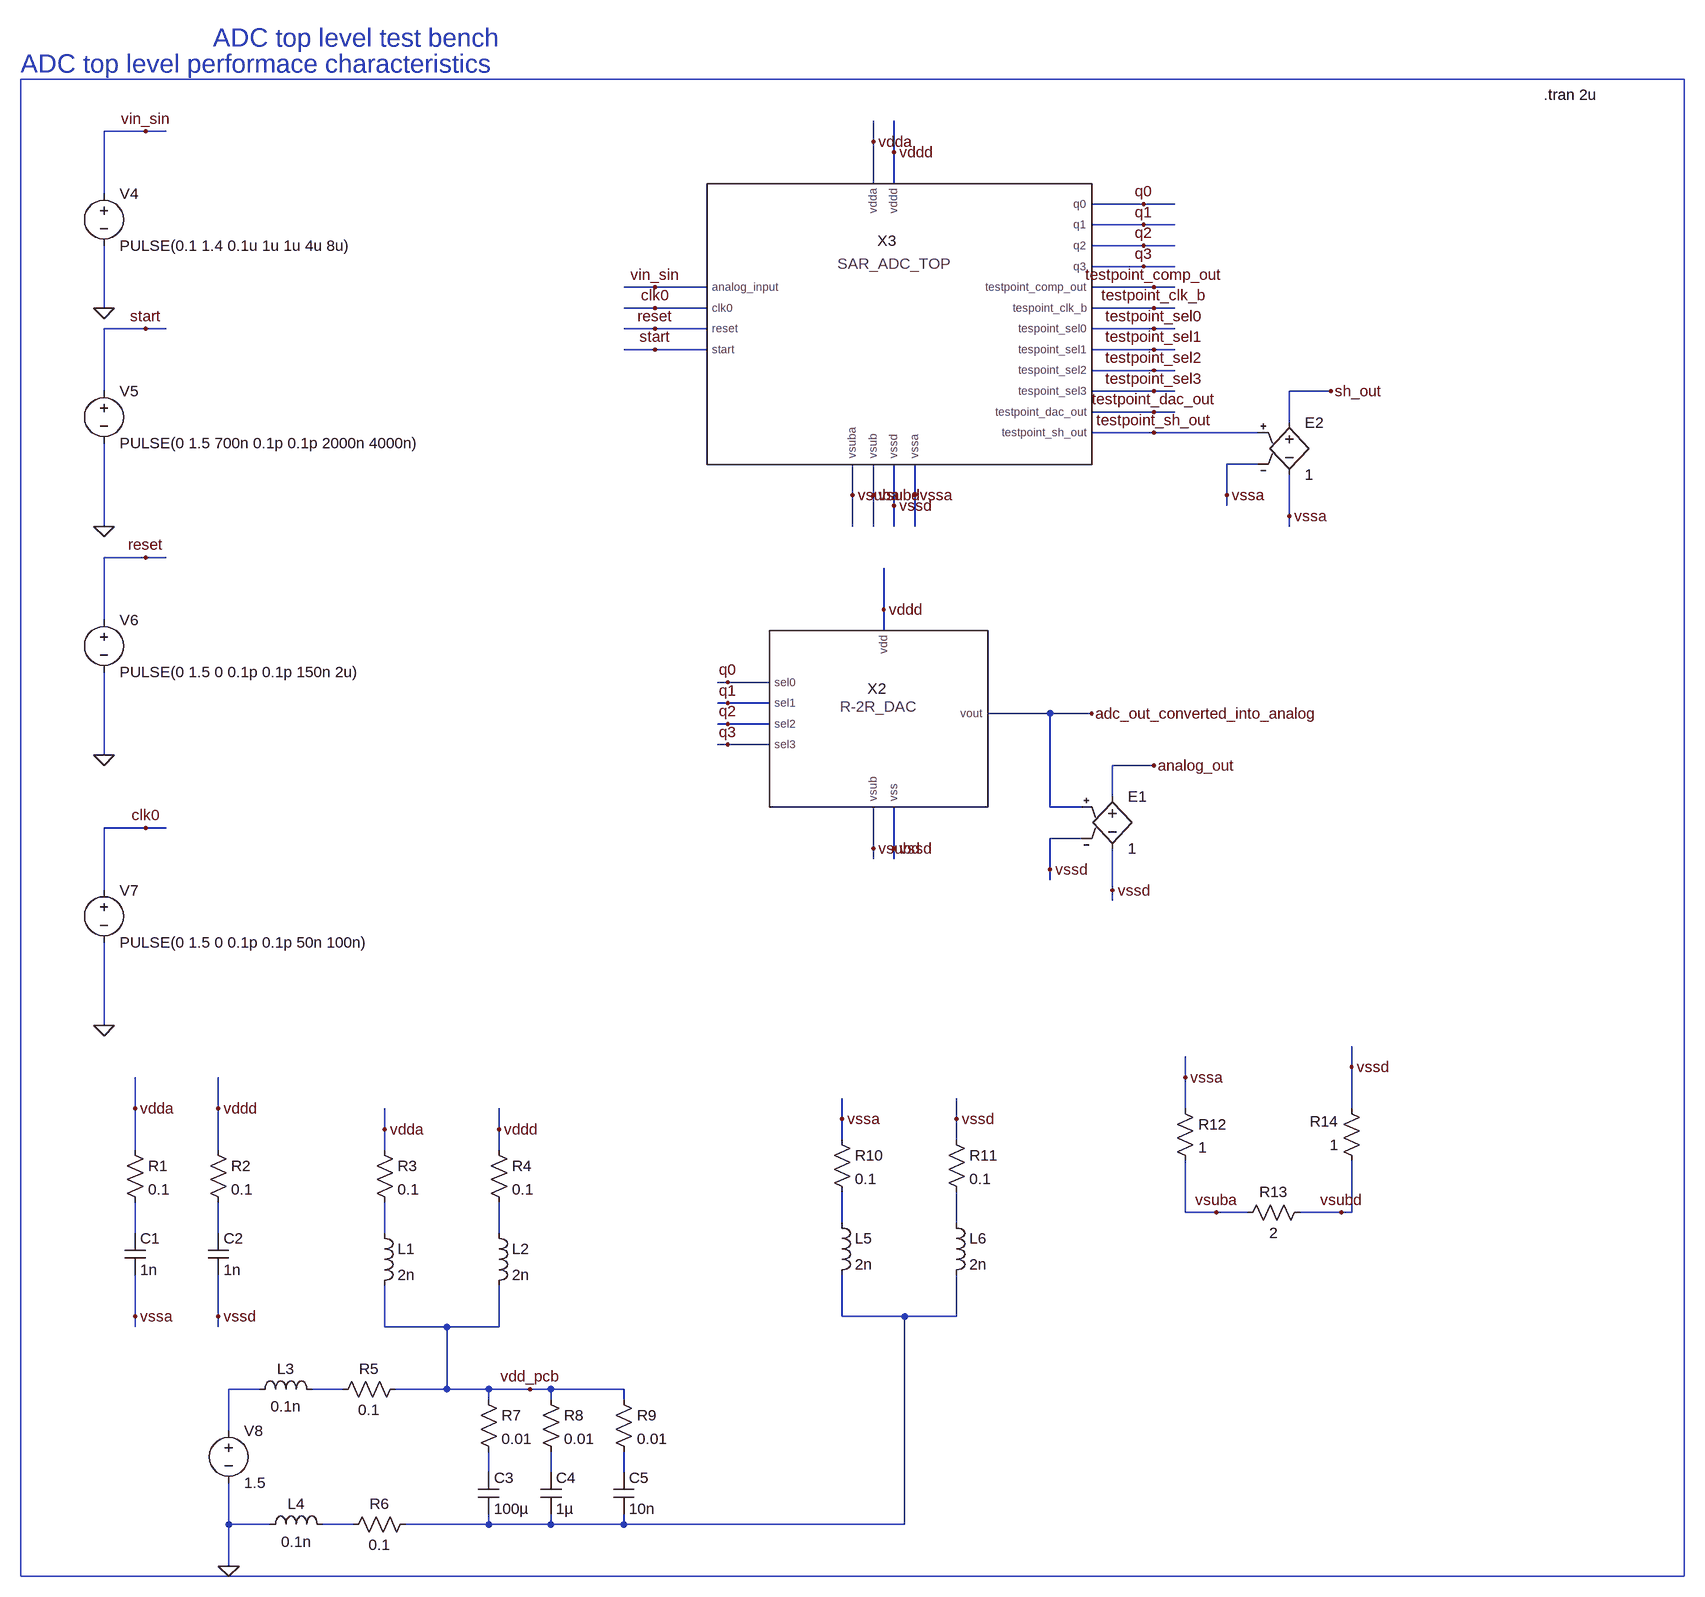
[diagram p0: schematic dsproj_adctop_perfCharacteristics_pdneffects.asc]
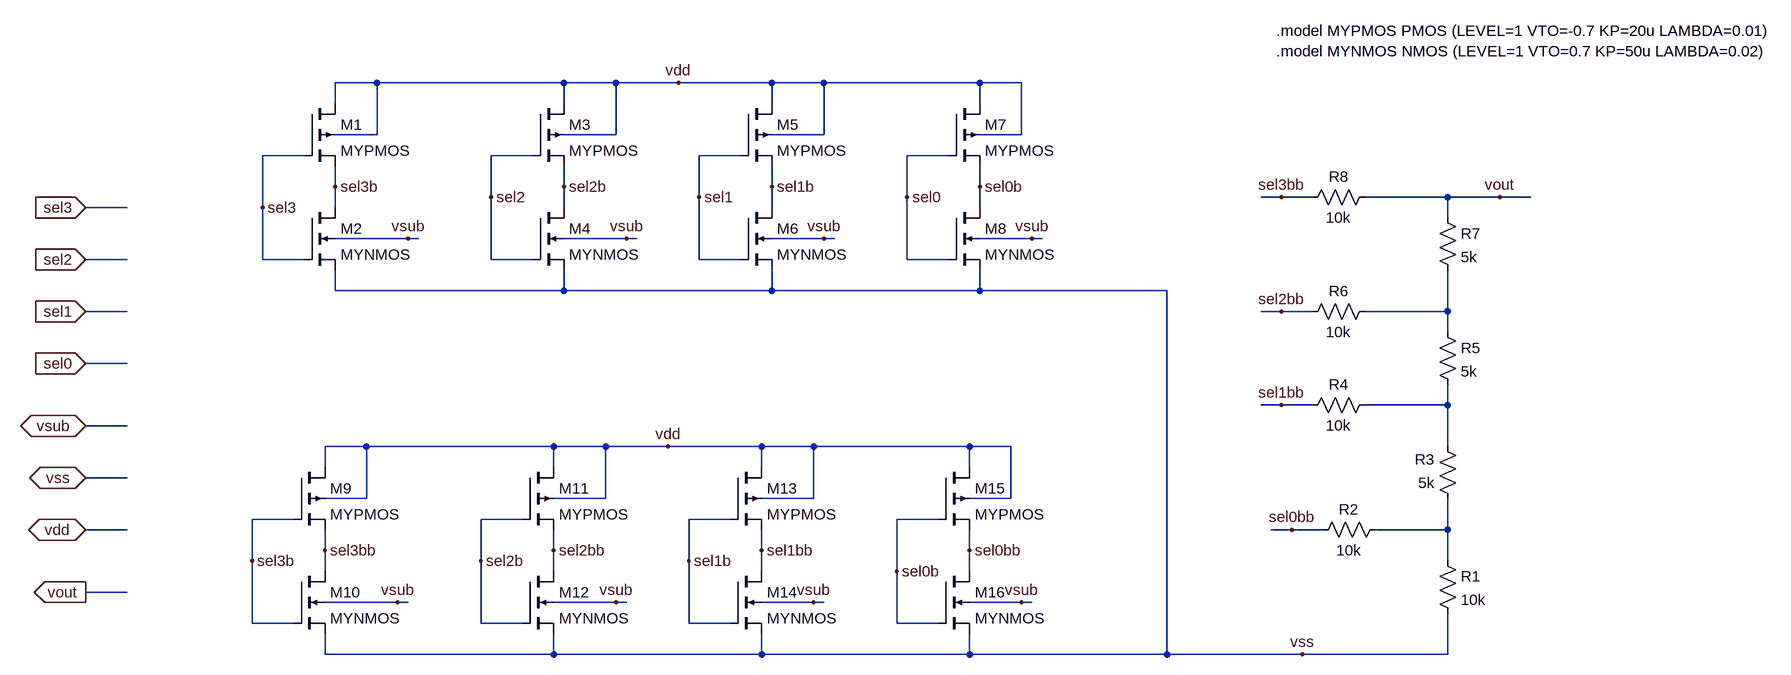
[diagram p1: sub-circuit dsproj_r2rdac.asc]
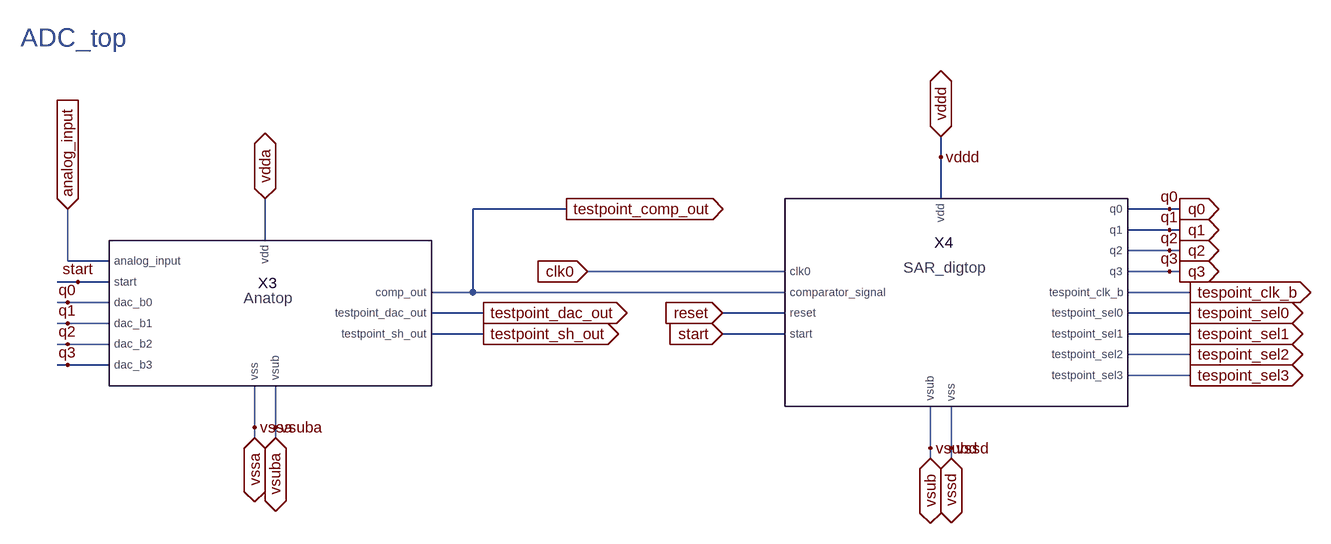
[diagram p2: sub-circuit dsproj_adctop.asc]
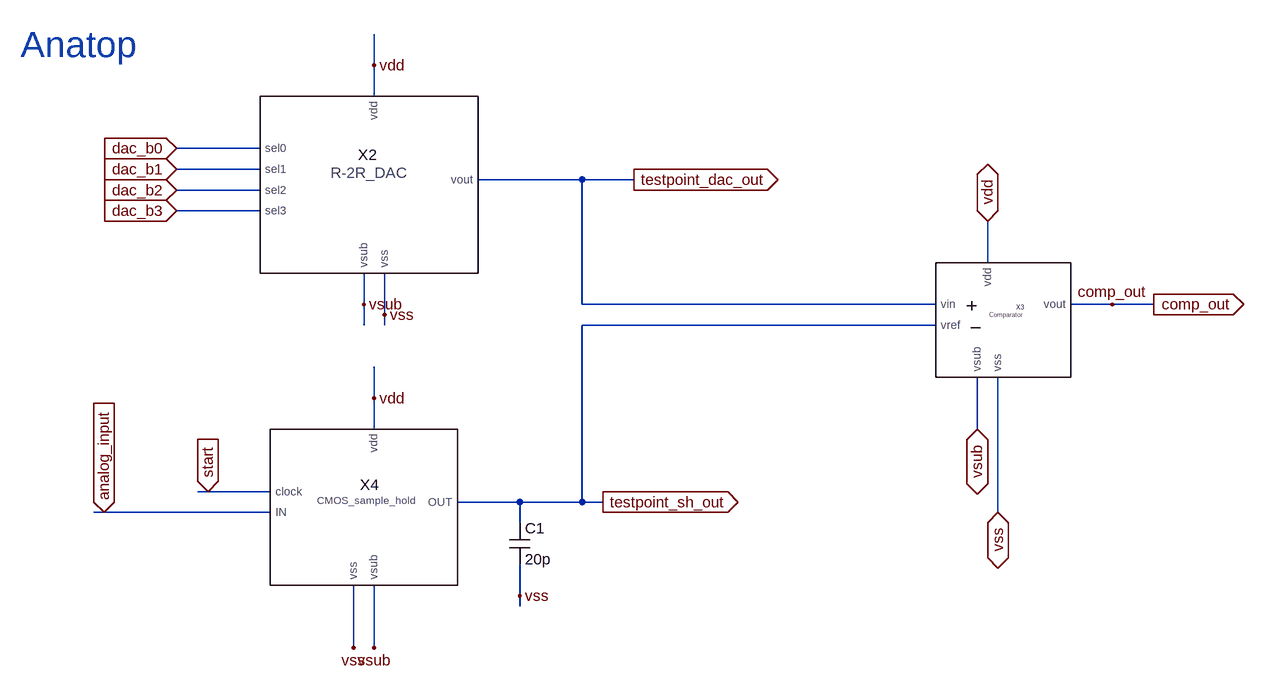
[diagram p3: sub-circuit dsproj_anatop.asc]
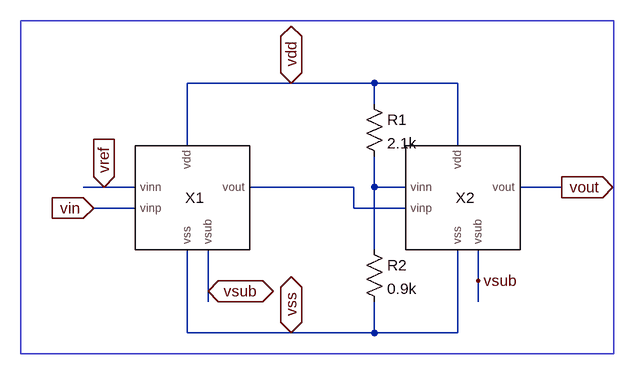
[diagram p4: sub-circuit dsproj_twostagecomparator.asc]
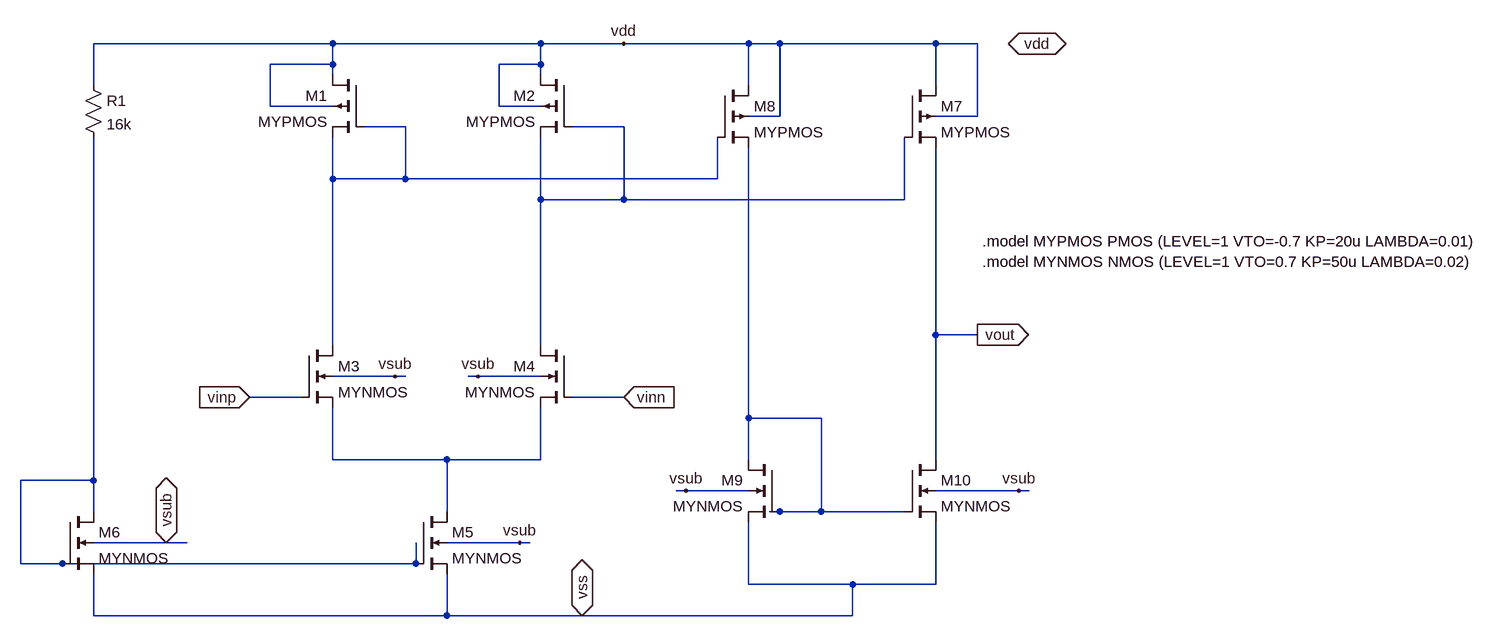
[diagram p5: sub-circuit dsproj_nmos_comparator.asc]
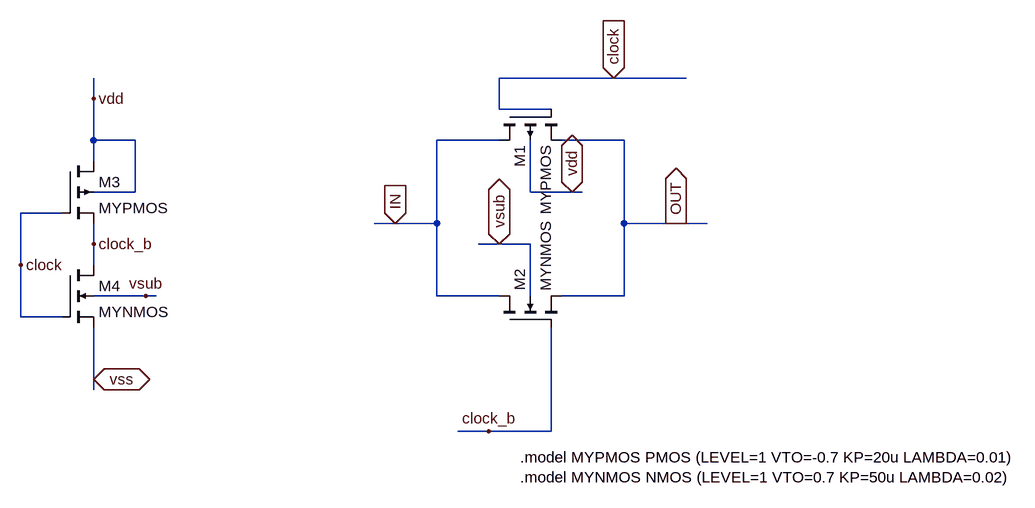
[diagram p6: sub-circuit dsproj_cmossampleandhold.asc]
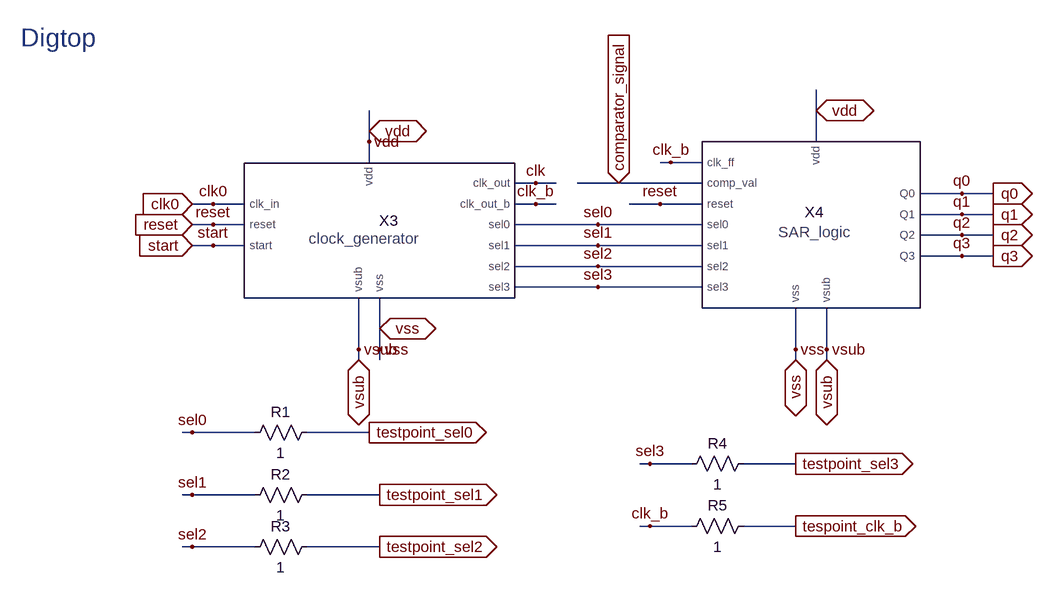
[diagram p7: sub-circuit dsproj_digtop.asc]
dsproj_adctop_perfCharacteristics_pdneffects.asc, the LTspice schematic file:
Version 4.1
SHEET 1 2676 2148
WIRE -352 -192 -416 -192
WIRE -320 -192 -352 -192
WIRE 768 -176 768 -208
WIRE 800 -160 800 -208
WIRE 768 -112 768 -176
WIRE 800 -112 800 -160
WIRE -416 -96 -416 -192
WIRE 1184 -80 1104 -80
WIRE 1232 -80 1184 -80
WIRE 1184 -48 1104 -48
WIRE 1232 -48 1184 -48
WIRE 1184 -16 1104 -16
WIRE 1232 -16 1184 -16
WIRE 1184 16 1104 16
WIRE 1232 16 1184 16
WIRE 432 48 384 48
WIRE 512 48 432 48
WIRE 1200 48 1104 48
WIRE 1232 48 1200 48
WIRE -416 80 -416 -16
WIRE 432 80 384 80
WIRE 512 80 432 80
WIRE 1200 80 1104 80
WIRE 1232 80 1200 80
WIRE -352 112 -416 112
WIRE -320 112 -352 112
WIRE 432 112 384 112
WIRE 512 112 432 112
WIRE 1200 112 1104 112
WIRE 1232 112 1200 112
WIRE 432 144 384 144
WIRE 512 144 432 144
WIRE 1200 144 1104 144
WIRE 1232 144 1200 144
WIRE 1200 176 1104 176
WIRE 1232 176 1200 176
WIRE -416 208 -416 112
WIRE 1200 208 1104 208
WIRE 1232 208 1200 208
WIRE 1472 208 1408 208
WIRE 1200 240 1104 240
WIRE 1232 240 1200 240
WIRE 1408 256 1408 208
WIRE 1200 272 1104 272
WIRE 1360 272 1200 272
WIRE 1360 320 1312 320
WIRE 736 368 736 320
WIRE 768 368 768 320
WIRE 832 368 832 320
WIRE 1312 368 1312 320
WIRE 800 384 800 320
WIRE 1312 384 1312 368
WIRE 1408 400 1408 336
WIRE -416 416 -416 288
WIRE 736 416 736 368
WIRE 768 416 768 368
WIRE 800 416 800 384
WIRE 832 416 832 368
WIRE 1408 416 1408 400
WIRE -352 464 -416 464
WIRE -320 464 -352 464
WIRE 784 544 784 480
WIRE -416 560 -416 464
WIRE 784 576 784 544
WIRE 544 656 528 656
WIRE 608 656 544 656
WIRE 544 688 528 688
WIRE 608 688 544 688
WIRE 1040 704 944 704
WIRE 1104 704 1040 704
WIRE 544 720 528 720
WIRE 608 720 544 720
WIRE 544 752 528 752
WIRE 608 752 544 752
WIRE -416 768 -416 640
WIRE 1200 784 1136 784
WIRE 1136 832 1136 784
WIRE 1040 848 1040 704
WIRE 1088 848 1040 848
WIRE -352 880 -416 880
WIRE -320 880 -352 880
WIRE 1088 896 1040 896
WIRE 768 912 768 848
WIRE 800 912 800 848
WIRE 768 928 768 912
WIRE 800 928 800 912
WIRE 1040 944 1040 896
WIRE 1040 960 1040 944
WIRE -416 976 -416 880
WIRE 1136 976 1136 912
WIRE 1136 992 1136 976
WIRE -416 1184 -416 1056
WIRE 1504 1248 1504 1216
WIRE 1248 1264 1248 1232
WIRE -368 1312 -368 1264
WIRE -240 1312 -240 1264
WIRE 1248 1312 1248 1264
WIRE 1504 1312 1504 1248
WIRE 720 1328 720 1296
WIRE 896 1328 896 1296
WIRE 16 1344 16 1312
WIRE 192 1344 192 1312
WIRE 720 1360 720 1328
WIRE 896 1360 896 1328
WIRE -368 1376 -368 1312
WIRE -240 1376 -240 1312
WIRE 16 1376 16 1344
WIRE 192 1376 192 1344
WIRE 1248 1472 1248 1392
WIRE 1296 1472 1248 1472
WIRE 1344 1472 1296 1472
WIRE 1488 1472 1424 1472
WIRE 1504 1472 1504 1392
WIRE 1504 1472 1488 1472
WIRE 720 1488 720 1440
WIRE 896 1488 896 1440
WIRE -368 1504 -368 1456
WIRE -240 1504 -240 1456
WIRE 16 1504 16 1456
WIRE 192 1504 192 1456
WIRE -368 1632 -368 1568
WIRE -240 1632 -240 1568
WIRE 720 1632 720 1568
WIRE 816 1632 720 1632
WIRE 896 1632 896 1568
WIRE 896 1632 816 1632
WIRE -368 1648 -368 1632
WIRE -240 1648 -240 1632
WIRE 16 1648 16 1584
WIRE 112 1648 16 1648
WIRE 192 1648 192 1584
WIRE 192 1648 112 1648
WIRE -176 1744 -224 1744
WIRE -48 1744 -96 1744
WIRE 112 1744 112 1648
WIRE 112 1744 32 1744
WIRE 176 1744 112 1744
WIRE 240 1744 176 1744
WIRE 272 1744 240 1744
WIRE 384 1744 272 1744
WIRE 176 1760 176 1744
WIRE 272 1760 272 1744
WIRE 384 1760 384 1744
WIRE -224 1808 -224 1744
WIRE 176 1872 176 1840
WIRE 272 1872 272 1840
WIRE 384 1872 384 1840
WIRE -224 1952 -224 1888
WIRE -160 1952 -224 1952
WIRE -32 1952 -80 1952
WIRE 176 1952 176 1936
WIRE 176 1952 48 1952
WIRE 272 1952 272 1936
WIRE 272 1952 176 1952
WIRE 384 1952 384 1936
WIRE 384 1952 272 1952
WIRE 816 1952 816 1632
WIRE 816 1952 384 1952
WIRE -224 2016 -224 1952
FLAG 768 -176 vdda
FLAG 800 -160 vddd
FLAG 736 368 vsuba
FLAG 768 368 vsubd
FLAG 800 384 vssd
FLAG 832 368 vssa
FLAG 1184 -80 q0
FLAG 1184 -48 q1
FLAG 1184 -16 q2
FLAG 1184 16 q3
FLAG 1200 80 testpoint_clk_b
FLAG 1200 112 testpoint_sel0
FLAG 1200 144 testpoint_sel1
FLAG 1200 176 testpoint_sel2
FLAG 1200 208 testpoint_sel3
FLAG 1200 240 testpoint_dac_out
FLAG 1200 272 testpoint_sh_out
FLAG 1200 48 testpoint_comp_out
FLAG 432 48 vin_sin
FLAG 432 80 clk0
FLAG 432 112 reset
FLAG 432 144 start
FLAG -416 80 0
FLAG -352 -192 vin_sin
FLAG -416 416 0
FLAG -352 112 start
FLAG -416 768 0
FLAG -352 464 reset
FLAG -416 1184 0
FLAG -352 880 clk0
FLAG 544 656 q0
FLAG 544 688 q1
FLAG 544 720 q2
FLAG 544 752 q3
FLAG 784 544 vddd
FLAG 768 912 vsubd
FLAG 800 912 vssd
FLAG 1104 704 adc_out_converted_into_analog
FLAG 1040 944 vssd
FLAG 1136 976 vssd
FLAG 1200 784 analog_out
FLAG 1312 368 vssa
FLAG 1408 400 vssa
FLAG 1472 208 sh_out
FLAG -368 1632 vssa
FLAG -368 1312 vdda
FLAG -240 1632 vssd
FLAG -240 1312 vddd
FLAG 16 1344 vdda
FLAG 192 1344 vddd
FLAG -224 2016 0
FLAG 240 1744 vdd_pcb
FLAG 720 1328 vssa
FLAG 896 1328 vssd
FLAG 1248 1264 vssa
FLAG 1504 1248 vssd
FLAG 1296 1472 vsuba
FLAG 1488 1472 vsubd
SYMBOL voltage -416 -112 R0
WINDOW 123 0 0 Left 0
WINDOW 39 0 0 Left 0
SYMATTR InstName V4
SYMATTR Value PULSE(0.1 1.4 0.1u 1u 1u 4u 8u)
SYMBOL voltage -416 192 R0
WINDOW 123 0 0 Left 0
WINDOW 39 0 0 Left 0
SYMATTR InstName V5
SYMATTR Value PULSE(0 1.5 700n 0.1p 0.1p 2000n 4000n)
SYMBOL voltage -416 544 R0
WINDOW 123 0 0 Left 0
WINDOW 39 0 0 Left 0
SYMATTR InstName V6
SYMATTR Value PULSE(0 1.5 0 0.1p 0.1p 150n 2u)
SYMBOL voltage -416 960 R0
WINDOW 123 0 0 Left 0
WINDOW 39 0 0 Left 0
SYMATTR InstName V7
SYMATTR Value PULSE(0 1.5 0 0.1p 0.1p 50n 100n)
SYMBOL dsproj_r2rdac 704 784 R0
SYMATTR InstName X2
SYMBOL e 1136 816 R0
SYMATTR InstName E1
SYMATTR Value 1
SYMBOL e 1408 240 R0
SYMATTR InstName E2
SYMATTR Value 1
SYMBOL res -384 1360 R0
SYMATTR InstName R1
SYMATTR Value 0.1
SYMBOL cap -384 1504 R0
SYMATTR InstName C1
SYMATTR Value 1n
SYMBOL res -256 1360 R0
SYMATTR InstName R2
SYMATTR Value 0.1
SYMBOL cap -256 1504 R0
SYMATTR InstName C2
SYMATTR Value 1n
SYMBOL res 0 1360 R0
SYMATTR InstName R3
SYMATTR Value 0.1
SYMBOL res 176 1360 R0
SYMATTR InstName R4
SYMATTR Value 0.1
SYMBOL ind 0 1488 R0
SYMATTR InstName L1
SYMATTR Value 2n
SYMBOL ind 176 1488 R0
SYMATTR InstName L2
SYMATTR Value 2n
SYMBOL ind -192 1760 R270
WINDOW 0 32 56 VTop 2
WINDOW 3 5 56 VBottom 2
SYMATTR InstName L3
SYMATTR Value 0.1n
SYMBOL res 48 1728 R90
WINDOW 0 0 56 VBottom 2
WINDOW 3 32 56 VTop 2
SYMATTR InstName R5
SYMATTR Value 0.1
SYMBOL ind -176 1968 R270
WINDOW 0 32 56 VTop 2
WINDOW 3 5 56 VBottom 2
SYMATTR InstName L4
SYMATTR Value 0.1n
SYMBOL res 64 1936 R90
WINDOW 0 0 56 VBottom 2
WINDOW 3 32 56 VTop 2
SYMATTR InstName R6
SYMATTR Value 0.1
SYMBOL voltage -224 1792 R0
WINDOW 123 0 0 Left 0
WINDOW 39 0 0 Left 0
SYMATTR InstName V8
SYMATTR Value 1.5
SYMBOL res 160 1744 R0
SYMATTR InstName R7
SYMATTR Value 0.01
SYMBOL cap 160 1872 R0
SYMATTR InstName C3
SYMATTR Value 100µ
SYMBOL res 256 1744 R0
SYMATTR InstName R8
SYMATTR Value 0.01
SYMBOL cap 256 1872 R0
SYMATTR InstName C4
SYMATTR Value 1µ
SYMBOL res 368 1744 R0
SYMATTR InstName R9
SYMATTR Value 0.01
SYMBOL cap 368 1872 R0
SYMATTR InstName C5
SYMATTR Value 10n
SYMBOL res 704 1344 R0
SYMATTR InstName R10
SYMATTR Value 0.1
SYMBOL res 880 1344 R0
SYMATTR InstName R11
SYMATTR Value 0.1
SYMBOL ind 704 1472 R0
SYMATTR InstName L5
SYMATTR Value 2n
SYMBOL ind 880 1472 R0
SYMATTR InstName L6
SYMATTR Value 2n
SYMBOL res 1232 1296 R0
SYMATTR InstName R12
SYMATTR Value 1
SYMBOL res 1440 1456 R90
WINDOW 0 0 56 VBottom 2
WINDOW 3 32 56 VTop 2
SYMATTR InstName R13
SYMATTR Value 2
SYMBOL res 1520 1408 R180
WINDOW 0 36 76 Left 2
WINDOW 3 36 40 Left 2
SYMATTR InstName R14
SYMATTR Value 1
SYMBOL dsproj_adctop 752 112 R0
SYMATTR InstName X3
TEXT 1800 -248 Left 2 !.tran 2u
TEXT -248 -336 Left 4 ;ADC top level test bench
TEXT -544 -296 Left 4 ;ADC top level performace characteristics
RECTANGLE Normal 2016 2032 -544 -272

The netlist it stands for:
* dsproj_adctop_perfCharacteristics_pdneffects.asc
V4 vin_sin 0 PULSE(0.1 1.4 0.1u 1u 1u 4u 8u)
V5 start 0 PULSE(0 1.5 700n 0.1p 0.1p 2000n 4000n)
V6 reset 0 PULSE(0 1.5 0 0.1p 0.1p 150n 2u)
V7 clk0 0 PULSE(0 1.5 0 0.1p 0.1p 50n 100n)
X§X2 q0 q1 q2 q3 vddd adc_out_converted_into_analog vssd vsubd dsproj_r2rdac
E1 analog_out vssd adc_out_converted_into_analog vssd 1
E2 sh_out vssa testpoint_sh_out vssa 1
R1 vdda N003 0.1
C1 N003 vssa 1n
R2 vddd N004 0.1
C2 N004 vssd 1n
R3 vdda N005 0.1
R4 vddd N006 0.1
L1 N005 vdd_pcb 2n
L2 N006 vdd_pcb 2n
L3 N008 N009 0.1n
R5 vdd_pcb N009 0.1
L4 0 N013 0.1n
R6 N007 N013 0.1
V8 N008 0 1.5
R7 vdd_pcb N010 0.01
C3 N010 N007 100µ
R8 vdd_pcb N011 0.01
C4 N011 N007 1µ
R9 vdd_pcb N012 0.01
C5 N012 N007 10n
R10 vssa N001 0.1
R11 vssd N002 0.1
L5 N001 N007 2n
L6 N002 N007 2n
R12 vssa vsuba 1
R13 vsubd vsuba 2
R14 vsubd vssd 1
X§X3 vin_sin clk0 reset start testpoint_clk_b testpoint_sel0 testpoint_sel1 testpoint_sel2 testpoint_sel3 testpoint_dac_out testpoint_sh_out vdda vddd vssa vssd vsubd vsuba q0 q1 q2 q3 testpoint_comp_out dsproj_adctop

* block symbol definitions
.subckt dsproj_r2rdac sel0 sel1 sel2 sel3 vdd vout vss vsub
M1 vdd sel3 sel3b vdd MYPMOS l=180e-9 w=2.4e-6
M2 sel3b sel3 vss vsub MYNMOS l=180e-9 w=1.2e-6
M3 vdd sel2 sel2b vdd MYPMOS l=180e-9 w=2.4e-6 m=1
M4 sel2b sel2 vss vsub MYNMOS l=180e-9 w=1.2e-6 m=1
M5 vdd sel1 sel1b vdd MYPMOS l=180e-9 w=2.4e-6 m=1
M6 sel1b sel1 vss vsub MYNMOS l=180e-9 w=1.2e-6 m=1
M7 vdd sel0 sel0b vdd MYPMOS l=180e-9 w=2.4e-6 m=1
M8 sel0b sel0 vss vsub MYNMOS l=180e-9 w=1.2e-6 m=1
M9 vdd sel3b sel3bb vdd MYPMOS l=180e-9 w=2.4e-6 m=1
M10 sel3bb sel3b vss vsub MYNMOS l=180e-9 w=1.2e-6 m=1
M11 vdd sel2b sel2bb vdd MYPMOS l=180e-9 w=2.4e-6 m=1
M12 sel2bb sel2b vss vsub MYNMOS l=180e-9 w=1.2e-6 m=1
M13 vdd sel1b sel1bb vdd MYPMOS l=180e-9 w=2.4e-6 m=1
M14 sel1bb sel1b vss vsub MYNMOS l=180e-9 w=1.2e-6 m=1
M15 vdd sel0b sel0bb vdd MYPMOS l=180e-9 w=2.4e-6 m=1
M16 sel0bb sel0b vss vsub MYNMOS l=180e-9 w=1.2e-6 m=1
R1 N003 vss 10k
R2 N003 sel0bb 10k
R3 N003 N002 5k
R4 sel1bb N002 10k
R5 N001 N002 5k
R6 N001 sel2bb 10k
R7 vout N001 5k
R8 vout sel3bb 10k
.model MYPMOS PMOS (LEVEL=1 VTO=-0.7 KP=20u LAMBDA=0.01)
.model MYNMOS NMOS (LEVEL=1 VTO=0.7 KP=50u LAMBDA=0.02)
.ends dsproj_r2rdac

.subckt dsproj_adctop analog_input clk0 reset start tespoint_clk_b tespoint_sel0 tespoint_sel1 tespoint_sel2 tespoint_sel3 testpoint_dac_out testpoint_sh_out vdda vddd vssa vssd vsub vsuba q0 q1 q2 q3 testpoint_comp_out
X§X3 analog_input q0 q1 q2 q3 testpoint_comp_out testpoint_dac_out testpoint_sh_out vdda vssa vsuba start dsproj_anatop
X§X4 clk0 testpoint_comp_out reset start q0 q1 q2 q3 tespoint_clk_b tespoint_sel0 tespoint_sel1 tespoint_sel2 tespoint_sel3 vddd vssd vsub dsproj_digtop
* ADC_top
.ends dsproj_adctop

.subckt dsproj_anatop analog_input dac_b0 dac_b1 dac_b2 dac_b3 comp_out testpoint_dac_out testpoint_sh_out vdd vss vsub start
X§X2 dac_b0 dac_b1 dac_b2 dac_b3 vdd testpoint_dac_out vss vsub dsproj_r2rdac
X§X3 testpoint_dac_out testpoint_sh_out vdd comp_out vss vsub dsproj_twostagecomparator
C1 testpoint_sh_out vss 20p
X§X4 analog_input start testpoint_sh_out vdd vsub vss dsproj_cmossampleandhold
* Anatop
.ends dsproj_anatop

.subckt dsproj_twostagecomparator vin vref vdd vout vss vsub
XX1 vref vin vdd N001 vss vsub dsproj_nmos_comparator
XX2 N002 N001 vdd vout vss vsub dsproj_nmos_comparator
R1 vdd N002 2.1k
R2 N002 vss 0.9k
.ends dsproj_twostagecomparator

.subckt dsproj_nmos_comparator vinn vinp vdd vout vss vsub
M1 vdd N001 N001 vdd MYPMOS l=180e-9 w=1.2e-6 m=2
M2 vdd N002 N002 vdd MYPMOS l=180e-9 w=1.2e-6 m=2
M4 N002 vinn N004 vsub MYNMOS l=180e-9 w=1.2e-6 m=3
M5 N004 N005 vss vsub MYNMOS l=3e-6 w=10e-6 m=2
R1 vdd N005 16k
M6 N005 N005 vss vsub MYNMOS l=3e-6 w=10e-6 m=2
M3 N001 vinp N004 vsub MYNMOS l=180e-9 w=1.2e-6 m=3
M7 vdd N002 vout vdd MYPMOS l=180e-9 w=1.2e-6 m=2
M8 vdd N001 N003 vdd MYPMOS l=180e-9 w=1.2e-6 m=2
M9 N003 N003 vss vsub MYNMOS l=180e-9 w=1.2e-6 m=1
M10 vout N003 vss vsub MYNMOS l=180e-9 w=1.2e-6 m=1
.model MYPMOS PMOS (LEVEL=1 VTO=-0.7 KP=20u LAMBDA=0.01)
.model MYNMOS NMOS (LEVEL=1 VTO=0.7 KP=50u LAMBDA=0.02)
.ends dsproj_nmos_comparator

.subckt dsproj_cmossampleandhold IN clock OUT vdd vsub vss
M1 IN clock OUT vdd MYPMOS l=180e-9 w=2400e-9
M2 IN clock_b OUT vsub MYNMOS l=180e-9 w=1200e-9
M3 vdd clock clock_b vdd MYPMOS l=180e-9 w=2.4e-6 m=1
M4 clock_b clock vss vsub MYNMOS l=180e-9 w=1.2e-6 m=1
.model MYPMOS PMOS (LEVEL=1 VTO=-0.7 KP=20u LAMBDA=0.01)
.model MYNMOS NMOS (LEVEL=1 VTO=0.7 KP=50u LAMBDA=0.02)
.ends dsproj_cmossampleandhold

.subckt dsproj_digtop clk0 comparator_signal reset start q0 q1 q2 q3 tespoint_clk_b testpoint_sel0 testpoint_sel1 testpoint_sel2 testpoint_sel3 vdd vss vsub
R1 testpoint_sel0 sel0 1
R2 testpoint_sel1 sel1 1
R3 testpoint_sel2 sel2 1
R4 testpoint_sel3 sel3 1
R5 tespoint_clk_b clk_b 1
X§X3 clk0 reset start clk clk_b sel0 sel1 sel2 sel3 vdd vss vsub dsproj_clkgenerator
X§X4 clk_b comparator_signal reset sel0 sel1 sel2 sel3 q0 q1 q2 q3 vsub vss vdd dsproj_sarlogicblock
* Digtop
.ends dsproj_digtop

.subckt dsproj_clkgenerator clk_in reset start clk_out clk_out_b sel0 sel1 sel2 sel3 vdd vss vsub
X§X1 start clr_ff1 start_d vss start_ff NC_01 vdd vss vsub dsproj_dff
X§X2 clk_ff reset start_ff vss sel3 NC_02 vdd vss vsub dsproj_dff
X§X3 clk_ff reset sel3 vss sel2 NC_03 vdd vss vsub dsproj_dff
X§X4 clk_ff reset sel2 vss sel1 NC_04 vdd vss vsub dsproj_dff
X§X5 clk_ff reset sel1 vss sel0 NC_05 vdd vss vsub dsproj_dff
X§X6 clk_in reset N002 vss clk_ff NC_06 vdd vss vsub dsproj_dff
R1 sel0 0 100e3
A1 start_ff 0 0 0 0 start_d 0 0 BUF
A2 clk_ff 0 0 0 0 N002 0 0 BUF
A3 0 sel3 reset 0 0 0 clr_ff1 0 OR
A4 clk_in 0 0 0 0 clk_out_b 0 0 BUF
A5 clk_out_b 0 0 0 0 clk_out 0 0 BUF
.model MYPMOS PMOS (LEVEL=1 VTO=-0.7 KP=20u LAMBDA=0.01)
.model MYNMOS NMOS (LEVEL=1 VTO=0.7 KP=50u LAMBDA=0.02)
.ends dsproj_clkgenerator

.subckt dsproj_dff CLK CLR D PRE Q Qb vdd vss vsub
A1 N004 0 N005 PRE N010 N006 N001 0 DFLOP
M1 vdd N003 N004 vdd MYPMOS l=180e-9 w=2400e-9
M2 N004 N003 vss vsub MYNMOS l=180e-9 w=1200e-9
M3 vdd D N003 vdd MYPMOS l=180e-9 w=2400e-9
M4 N003 D vss vsub MYNMOS l=180e-9 w=1200e-9
M5 vdd N007 N005 vdd MYPMOS l=180e-9 w=2400e-9
M6 N005 N007 vss vsub MYNMOS l=180e-9 w=1200e-9
M7 vdd CLK N007 vdd MYPMOS l=180e-9 w=2400e-9
M8 N007 CLK vss vsub MYNMOS l=180e-9 w=1200e-9
M9 vdd N002 Q vdd MYPMOS l=180e-9 w=2400e-9
M10 Q N002 vss vsub MYNMOS l=180e-9 w=1200e-9
M11 vdd N001 N002 vdd MYPMOS l=180e-9 w=2400e-9
M12 N002 N001 vss vsub MYNMOS l=180e-9 w=1200e-9
M13 vdd N008 Qb vdd MYPMOS l=180e-9 w=2400e-9
M14 Qb N008 vss vsub MYNMOS l=180e-9 w=1200e-9
M15 vdd N006 N008 vdd MYPMOS l=180e-9 w=2400e-9
M16 N008 N006 vss vsub MYNMOS l=180e-9 w=1200e-9
M17 vdd N009 N010 vdd MYPMOS l=180e-9 w=2400e-9
M18 N010 N009 vss vsub MYNMOS l=180e-9 w=1200e-9
M19 vdd CLR N009 vdd MYPMOS l=180e-9 w=2400e-9
M20 N009 CLR vss vsub MYNMOS l=180e-9 w=1200e-9
.tran 200
.model MYPMOS PMOS (LEVEL=1 VTO=-0.7 KP=20u LAMBDA=0.01)
.model MYNMOS NMOS (LEVEL=1 VTO=0.7 KP=50u LAMBDA=0.02)
.ends dsproj_dff

.subckt dsproj_sarlogicblock clk_ff comp_val reset sel0 sel1 sel2 sel3 Q0 Q1 Q2 Q3 vsub vss vdd
X§X1 comp_val N001 sel0 vsub N002 vdd vss dsproj_2to1mux
X§X2 clk_ff_0 reset N002 vss Q0 NC_01 vdd vss vsub dsproj_dff
A1 Q0 0 0 0 0 N001 0 0 BUF
X§X3 comp_val N003 sel1 vsub N004 vdd vss dsproj_2to1mux
X§X4 clk_ff_1 reset N004 vss Q1 NC_02 vdd vss vsub dsproj_dff
A2 Q1 0 0 0 0 N003 0 0 BUF
X§X5 comp_val N005 sel2 vsub N006 vdd vss dsproj_2to1mux
X§X6 clk_ff_2 reset N006 vss Q2 NC_03 vdd vss vsub dsproj_dff
A3 Q2 0 0 0 0 N005 0 0 BUF
X§X7 comp_val N007 sel3 vsub N008 vdd vss dsproj_2to1mux
X§X8 clk_ff_3 reset N008 vss Q3 NC_04 vdd vss vsub dsproj_dff
A4 Q3 0 0 0 0 N007 0 0 BUF
A5 0 sel0 clk_ff vdd 0 0 clk_ff_0 0 AND
A6 0 sel1 clk_ff vdd 0 0 clk_ff_1 0 AND
A7 0 sel2 clk_ff vdd 0 0 clk_ff_2 0 AND
A8 0 sel3 clk_ff vdd 0 0 clk_ff_3 0 AND
.model MYPMOS PMOS (LEVEL=1 VTO=-0.7 KP=20u LAMBDA=0.01)
.model MYNMOS NMOS (LEVEL=1 VTO=0.7 KP=50u LAMBDA=0.02)
.ends dsproj_sarlogicblock

.subckt dsproj_2to1mux A B sela vsub out vdd vss
M1 vdd sela_b sela_bb vdd MYPMOS l=180e-9 w=2400e-9
M2 sela_bb sela_b vss vsub MYNMOS l=180e-9 w=1200e-9
M3 vdd sela sela_b vdd MYPMOS l=180e-9 w=2400e-9
M4 sela_b sela vss vsub MYNMOS l=180e-9 w=1200e-9
M5 N002 B out vdd MYPMOS l=180e-9 w=2400e-9
M6 out B N003 vsub MYNMOS l=180e-9 w=1200e-9
M7 N001 A out vdd MYPMOS l=180e-9 w=2400e-9
M8 out A N004 vsub MYNMOS l=180e-9 w=1200e-9
M9 vdd sela_b N001 vdd MYPMOS l=180e-9 w=2400e-9
M10 N004 sela_bb vss vsub MYNMOS l=180e-9 w=1200e-9
M11 vdd sela_bb N002 vdd MYPMOS l=180e-9 w=2400e-9
M12 N003 sela_b vss vsub MYNMOS l=180e-9 w=1200e-9
* 2-to-1-Mux
.model MYPMOS PMOS (LEVEL=1 VTO=-0.7 KP=20u LAMBDA=0.01)
.model MYNMOS NMOS (LEVEL=1 VTO=0.7 KP=50u LAMBDA=0.02)
.ends dsproj_2to1mux

.model NMOS NMOS
.model PMOS PMOS
.lib standard.mos
.tran 2u
* ADC top level test bench
* ADC top level performace characteristics
.backanno
.end